# EAGLE schematic FT232-Breakout-v1 (EAGLE 6.4)
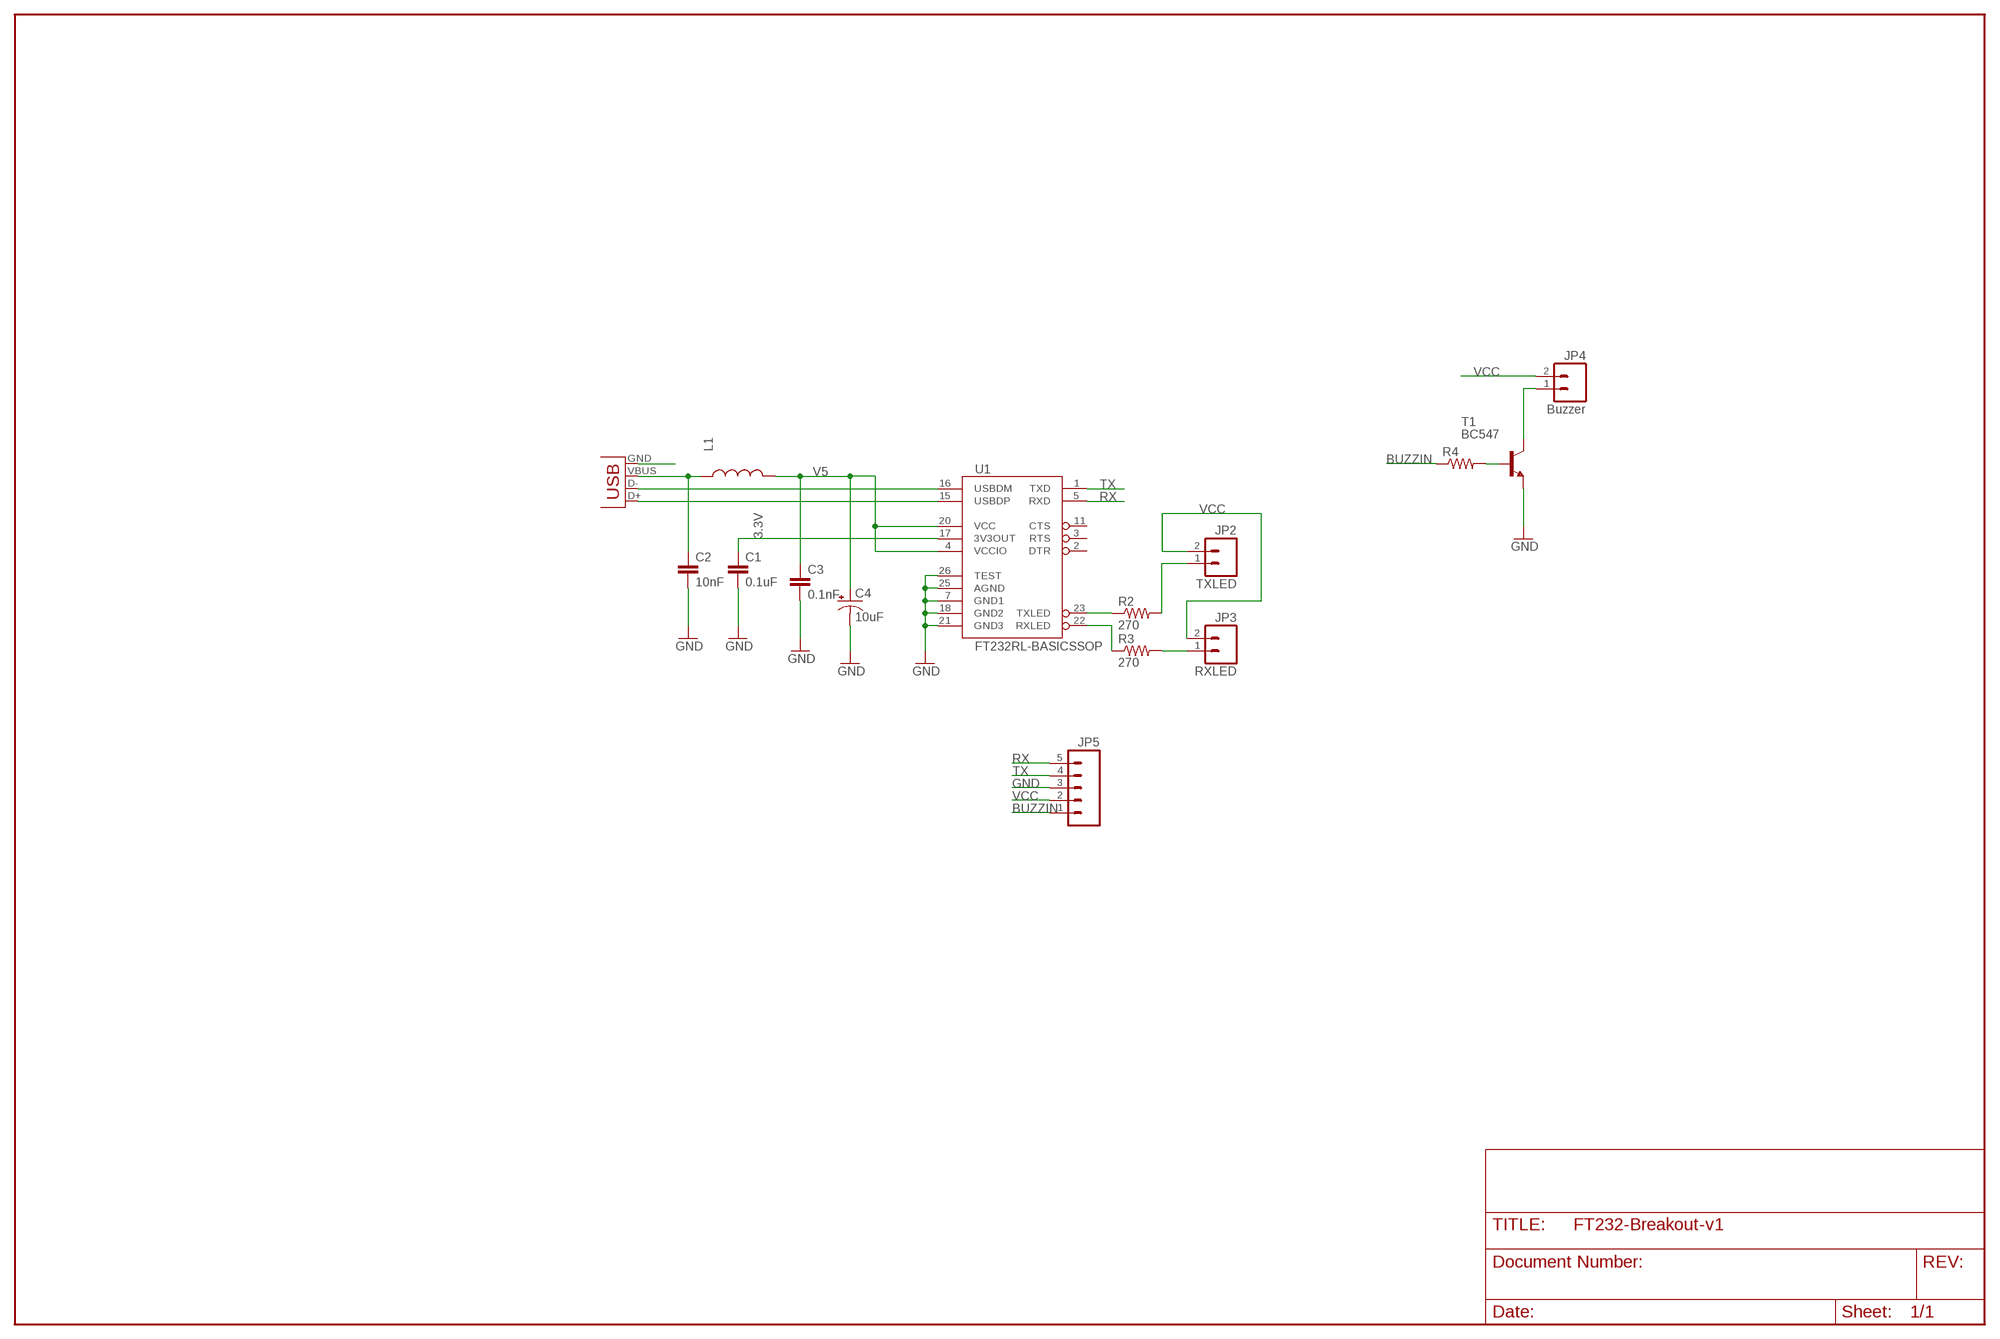
[diagram p0: schematic, sheet 1]

## Parts
C1  0.1uF  .22UF-CER  [0402-CAP]
C2  10nF  .22UF-CER  [0402-CAP]
C3  0.1nF  .22UF-CER  [0402-CAP]
C4  10uF  10UF-TANT  [EIA3216]
JP1  USB-B  USBPTH  [USB-B-PTH]
JP2  TXLED  M02LOCK  [1X02_LOCK]
JP3  RXLED  M02LOCK  [1X02_LOCK]
JP4  Buzzer  M02LOCK  [1X02_LOCK]
JP5  M05LOCK  [1X05_LOCK]
L1  INDUCTOR0603  [0603]
R2  270  RESISTORPTH-1/2W  [AXIAL-0.5]
R3  270  RESISTORPTH-1/2W  [AXIAL-0.5]
R4  RESISTORPTH-1/2W  [AXIAL-0.5]
T1  BC547  [TO92]
U1  FT232RL-BASICSSOP  [SSOP28DB]

## Nets
3.3V: C1.1 U1.17(3V3OUT)
BUZZIN: JP5.1 R4.P$1
GND: C1.2 C2.2 C3.2 C4.C(-) JP1.GND JP5.3 T1.1(E) U1.7(GND1) U1.18(GND2) U1.21(GND3) U1.25(AGND) U1.26(TEST)
N$1: C2.1 JP1.VBUS L1.1
N$2: R4.P$2 T1.2(B)
N$3: JP3.1 R3.P$2
N$4: JP1.D- U1.16(USBDM)
N$5: JP1.D+ U1.15(USBDP)
N$6: JP4.1 T1.3(C)
N$7: R3.P$1 U1.22(RXLED)
N$8: R2.P$1 U1.23(TXLED)
N$9: JP2.1 R2.P$2
RX: JP5.5 U1.5(RXD)
TX: JP5.4 U1.1(TXD)
V5: C3.1 C4.A(+) L1.2 U1.4(VCCIO) U1.20(VCC)
VCC: JP2.2 JP3.2 JP4.2 JP5.2
Unconnected: U1.2(DTR) U1.3(RTS) U1.11(CTS)

## Library data of the parts
C1-C3 = SparkFun-Capacitors:.22UF-CER: .22uF ceramic SMT CAP-09885- 50V +80%/-20% (0603); PROD_ID: CAP-09885; VALUE: .22uF
C4 = SparkFun-Capacitors:10UF-TANT: 10uF Tantalum SMT CAP-00811- 16V 10% (EIA-3216); PROD_ID: CAP-00811
JP1 = SparkFun-Connectors:USB: USB Connectors USB-B-PTH is fully proven SKU : PRT-00139/CONN-08278 USB-miniB is fully proven SKU : PRT-00587 USB-A-PCB is untested. USB-A-H is throughly reviewed, but untested. Spark Fun Electronics SKU : PRT-00437 USB-B-SMT is throughly reviewed, but untested. Needs silkscreen touching up. USB-A-S has not been used/tested USB-MB-H has not been used/tested USB-MICROB has been used. CONN-09505; PROD_ID: CONN-08278
JP2-JP4 = SparkFun-Connectors:M02: Standard 2-pin 0.1" header. Use with - straight break away headers ( PRT-00116) - right angle break away headers (PRT-00553) - swiss pins (PRT-00743) - machine pins (PRT-00117) - female headers (PRT-00115) Molex polarized connector foot print use with: PRT-08233 with associated crimp pins and housings. 2.54_SCREWTERM for use with PRT-10571. 3.5mm Screw Terminal footprints for PRT-08084 5mm Screw Terminal footprints for use with PRT-08433
JP5 = SparkFun-Connectors:M05: Header 5 Standard 5-pin 0.1" header. Use with straight break away headers (SKU : PRT-00116), right angle break away headers (PRT-00553), swiss pins (PRT-00743), machine pins (PRT-00117), and female headers (PRT-00115). Molex polarized connector foot print use with SKU : PRT-08230 with associated crimp pins and housings.
L1 = SparkFun-Passives:INDUCTOR: Inductors Basic Inductor/Choke - 0603 and 1206. Footprints are not proven and vary greatly between part numbers. SRN6045- 33uH, 20% 1.4A
R2-R4 = SparkFun-Passives:RESISTOR: Resistor Basic schematic elements and footprints for 0603, 1206, and PTH resistors.
T1 = transistor:BC547: NPN TRANSISTOR
U1 = SparkFun-DigitalIC:FT232RL-BASIC: USB UART This is the simplified version of the FT232RL unit. Only what you need, nothing you don't. Spark Fun Electronics SKU : COM-00650